# EAGLE design LGT-92 v1.5 (EAGLE 7.5.0)

## Sheet 1 of 3
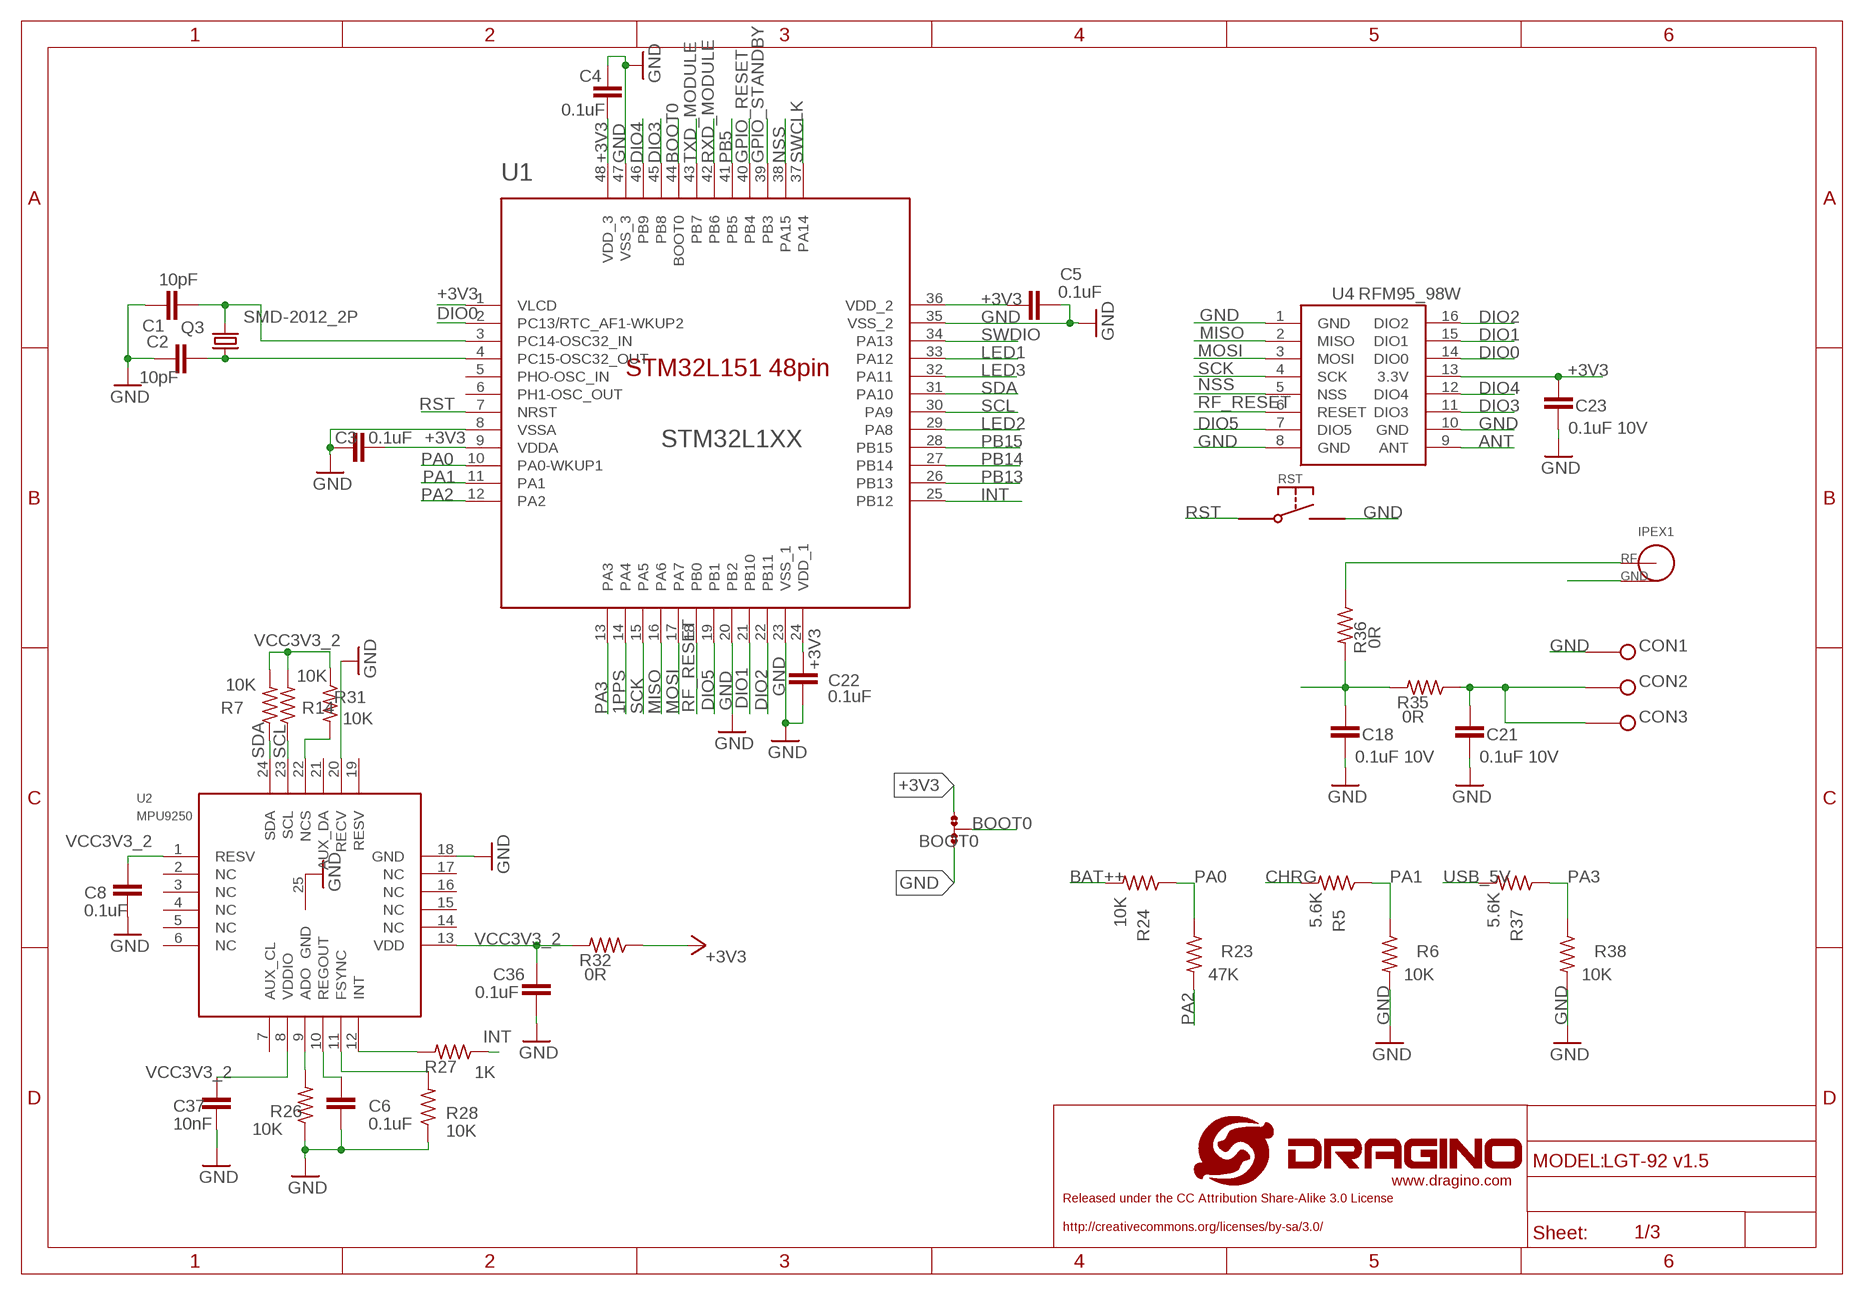
[diagram p0: schematic, sheet 1]

### Parts
BOOT0  0R-JUMPA0R-JMP-0402  [A0R-JMP-0402]
C1  10pF  C-EUC0402  [C0402]
C2  10pF  C-EUC0402  [C0402]
C3  0.1uF  C-EUC0402  [C0402]
C4  0.1uF  C-EUC0402  [C0402]
C5  0.1uF  C-EUC0402  [C0402]
C6  0.1uF  C-EUC0402  [C0402]
C8  0.1uF  C-EUC0402  [C0402]
C18  0.1uF 10V  C-EUC0402  [C0402]
C21  0.1uF 10V  C-EUC0402  [C0402]
C22  0.1uF  C-EUC0402  [C0402]
C23  0.1uF 10V  C-EUC0402  [C0402]
C36  0.1uF  C-EUC0402  [C0402]
C37  10nF  C-EUC0402  [C0402]
CON1  POGOPINSMT-2.0  [POGOPIN-SMT-2.0]
CON2  POGOPINSMT-2.0  [POGOPIN-SMT-2.0]
CON3  POGOPINSMT-2.0  [POGOPIN-SMT-2.0]
IPEX1  I-PEX  [I-PEX]
Q3  SMD-2012_2P  [32.768K]
R5  5.6K  R-US_R0402  [R0402]
R6  10K  R-US_R0402  [R0402]
R7  10K  R-US_R0402  [R0402]
R14  10K  R-US_R0402  [R0402]
R23  47K  R-US_R0402  [R0402]
R24  10K  R-US_R0402  [R0402]
R26  10K  R-US_R0402  [R0402]
R27  1K  R-US_R0402  [R0402]
R28  10K  R-US_R0402  [R0402]
R31  10K  R-US_R0402  [R0402]
R32  0R  R-US_R0402  [R0402]
R35  0R  R-US_R0402  [R0402]
R36  0R  R-US_R0402  [R0402]
R37  5.6K  R-US_R0402  [R0402]
R38  10K  R-US_R0402  [R0402]
RST  SWITCHTS-017  [TS-017]
U1  STM32L1XX  [STM32L1XX]
U2  MPU9250  [QFN-24]
U4  RFM95_98W  [RFM95_98W]

### Nets
1 [2layer_50ohm]: C21.2 CON2.1(TP) CON3.1(TP) R35.1
1PPS: U1.14(PA4) ; also sheet 3
+3V3: BOOT0.1 C3.1 C4.1 C5.2 C22.2 C23.2 R32.1 U1.1(VLCD) U1.9(VDDA) U1.24(VDD_1) U1.36(VDD_2) U1.48(VDD_3) U4.13(3.3V) ; also sheet 2,3
ANT [2layer_50ohm]: C18.2 R35.2 R36.2 U4.9(ANT)
BAT++: R24.2 ; also sheet 2,3
BOOT0: BOOT0.2 U1.44(BOOT0)
CHRG: R5.2 ; also sheet 2
DIO0: U1.2(PC13/RTC_AF1-WKUP2) U4.14(DIO0)
DIO1: U1.21(PB10) U4.15(DIO1)
DIO2: U1.22(PB11) U4.16(DIO2)
DIO3: U1.45(PB8) U4.11(DIO3)
DIO4: U1.46(PB9) U4.12(DIO4)
DIO5: U1.19(PB1) U4.7(DIO5)
GND [gnd]: BOOT0.3 C1.1 C2.1 C3.2 C4.2 C5.1 C6.1 C8.1 C18.1 C21.1 C22.1 C23.1 C36.1 C37.1 CON1.1(TP) IPEX1.GND IPEX1.GND1(GND) R6.2 R26.1 R28.1 R38.2 RST.P$2 U1.8(VSSA) U1.20(PB2) U1.23(VSS_1) U1.35(VSS_2) U1.47(VSS_3) U2.18(GND) U2.20(RECV) U2.25(GND) U4.1(GND) U4.8(GND) U4.10(GND) ; also sheet 2,3
GPIO_RESET: U1.40(PB4) ; also sheet 3
GPIO_STANDBY: U1.39(PB3) ; also sheet 3
INT: R27.1 U1.25(PB12)
LED1: U1.33(PA12) ; also sheet 3
LED2: U1.29(PA8) ; also sheet 3
LED3: U1.32(PA11) ; also sheet 3
MISO: U1.16(PA6) U4.2(MISO)
MOSI: U1.17(PA7) U4.3(MOSI)
N$9: C2.2 Q3.3 U1.4(PC15-OSC32_OUT)
N$12: C1.2 Q3.4 U1.3(PC14-OSC32_IN)
N$22: R31.2 U2.22(NCS)
N$23: IPEX1.SIG R36.1
N$44: R26.2 U2.9(ADO)
N$46: C6.2 U2.10(REGOUT)
N$48: R28.2 U2.11(FSYNC)
N$49: R27.2 U2.12(INT)
NSS: U1.38(PA15) U4.5(NSS)
PA0: R23.1 R24.1 U1.10(PA0-WKUP1)
PA1: R5.1 R6.1 U1.11(PA1)
PA2: R23.2 U1.12(PA2)
PA3: R37.1 R38.1 U1.13(PA3)
PB5: U1.41(PB5) ; also sheet 3
PB13: U1.26(PB13)
PB14: U1.27(PB14) ; also sheet 3
PB15: U1.28(PB15)
RF_RESET: U1.18(PB0) U4.6(RESET)
RST: RST.P$1 U1.7(NRST)
RXD_MODULE: U1.42(PB6) ; also sheet 3
SCK: U1.15(PA5) U4.4(SCK)
SCL: R14.1 U1.30(PA9) U2.23(SCL)
SDA: R7.1 U1.31(PA10) U2.24(SDA)
SWCLK: U1.37(PA14) ; also sheet 2
SWDIO: U1.34(PA13) ; also sheet 2
TXD_MODULE: U1.43(PB7) ; also sheet 3
USB_5V: R37.2 ; also sheet 2
VCC3V3_2: C8.2 C36.2 C37.2 R7.2 R14.2 R31.1 R32.2 U2.1(RESV) U2.8(VDDIO) U2.13(VDD)
Unconnected: U1.5(PHO-OSC_IN) U1.6(PH1-OSC_OUT) U2.2(NC) U2.3(NC) U2.4(NC) U2.5(NC) U2.6(NC) U2.7(AUX_CL) U2.14(NC) U2.15(NC) U2.16(NC) U2.17(NC) U2.19(RESV) U2.21(AUX_DA)

## Sheet 2 of 3
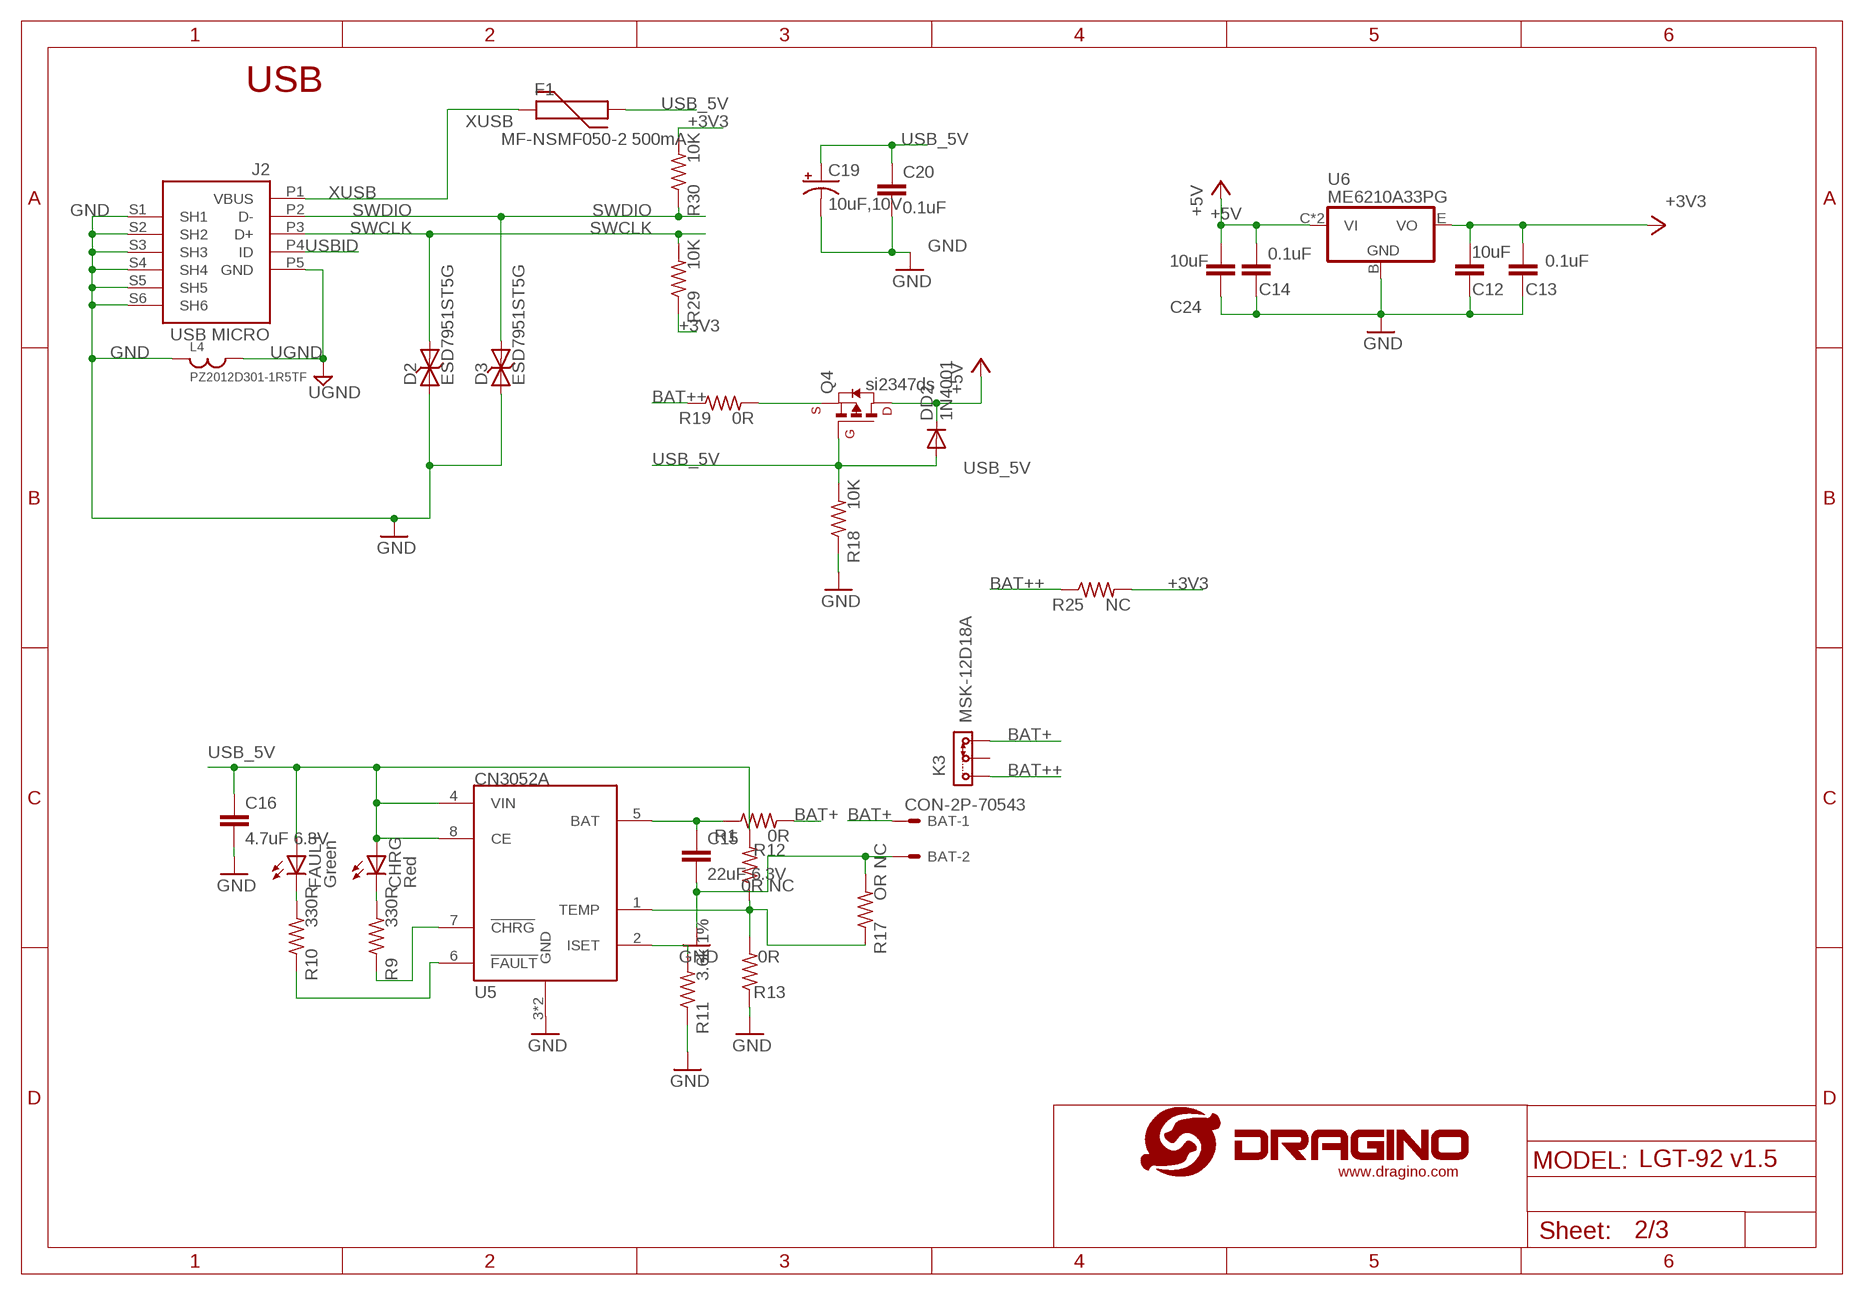
[diagram p1: schematic, sheet 2]

### Parts
BAT  CON-2P-70543  [70543-02]
C12  10uF  C-EUC0805  [C0805]
C13  0.1uF  C-EUC0402  [C0402]
C14  0.1uF  C-EUC0402  [C0402]
C15  22uF 6.3V  C-EUC0603  [C0603]
C16  4.7uF 6.3V  C-EUC0603  [C0603]
C19  10uF,10V  CPOL-USSMCA  [SMC_A]
C20  0.1uF  C-EUC0402  [C0402]
C24  10uF  C-EUC0805  [C0805]
CHRG  Red  DRAGINO_LEDCHIPLED_0603  [DRAGINO_CHIPLED_0603]
D2  ESD7951ST5G  TVSSOD?923  [SOD?923]
D3  ESD7951ST5G  TVSSOD?923  [SOD?923]
DD2  1N4001  DIODEDO214AC  [DIODE_DO214AC]
F1  MF-NSMF050-2 500mA  FUSE1206  [R1206$1]
FAULT  Green  DRAGINO_LEDCHIPLED_0603  [DRAGINO_CHIPLED_0603]
J2  USB MICRO  MYCON2_USB-MINI-B  [CON2_USB_MICRO_B_AT]
K3  MSK-12D18A  [MSK-12D18A]
L4  PZ2012D301-1R5TF  BEADS0805  [C0805]
Q4  si2347ds  P-MOSFET_HP  [SOT-23-HIGH-POWER]
R1  0R  R-US_R0805  [R0805]
R9  330R  R-US_R0402  [R0402]
R10  330R  R-US_R0402  [R0402]
R11  3.6k 1%  R-US_R0402  [R0402]
R12  0R NC  R-US_R0402  [R0402]
R13  0R  R-US_R0402  [R0402]
R17  OR NC  R-US_R0402  [R0402]
R18  10K  R-US_R0402  [R0402]
R19  0R  R-US_R0805  [R0805]
R25  NC  R-US_R0805  [R0805]
R29  10K  R-US_R0402  [R0402]
R30  10K  R-US_R0402  [R0402]
U5  CN3052A  [CN3052A]
U6  ME6210A33PG  [SOT-89]

### Nets
+3V3: C12.2 C13.2 R25.2 R29.1 R30.2 U6.E(VO) ; also sheet 1,3
+5V: C14.2 C24.2 DD2.C Q4.1(D) U6.C(VI) U6.C@1(VI)
BAT+: BAT.1 K3.3 R1.2
BAT++: K3.1 R19.1 R25.1 ; also sheet 1,3
CHRG: R9.1 U5.7(!CHRG) ; also sheet 1
GND [gnd]: BAT.2 C12.1 C13.1 C14.1 C15.2 C16.2 C19.- C20.2 C24.1 D2.P$1 D3.P$1 J2.S1(SH1) J2.S2(SH2) J2.S3(SH3) J2.S4(SH4) J2.S5(SH5) J2.S6(SH6) L4.1 R11.1 R13.1 R17.2 R18.1 U5.3(GND) U5.P$1(GND) U6.B(GND) ; also sheet 1,3
N$1: C15.1 R1.1 U5.5(BAT)
N$4: CHRG.C R9.2
N$7: FAULT.C R10.2
N$8: Q4.2(S) R19.2
N$11: R10.1 U5.6(!FAULT)
N$15: R12.1 R13.2 R17.1 U5.1(TEMP)
N$16: R11.2 U5.2(ISET)
SWCLK: D2.P$2 J2.P3(D+) R29.2 ; also sheet 1
SWDIO: D3.P$2 J2.P2(D-) R30.1 ; also sheet 1
UGND [gnd]: J2.P5(GND) L4.2
USB_5V: C16.1 C19.+ C20.1 CHRG.A DD2.A F1.1 FAULT.A Q4.3(G) R12.2 R18.2 U5.4(VIN) U5.8(CE) ; also sheet 1
USBID: J2.P4(ID)
XUSB [usbvcc]: F1.2 J2.P1(VBUS)
Unconnected: K3.2

### Notes on the sheet
- USB

## Sheet 3 of 3
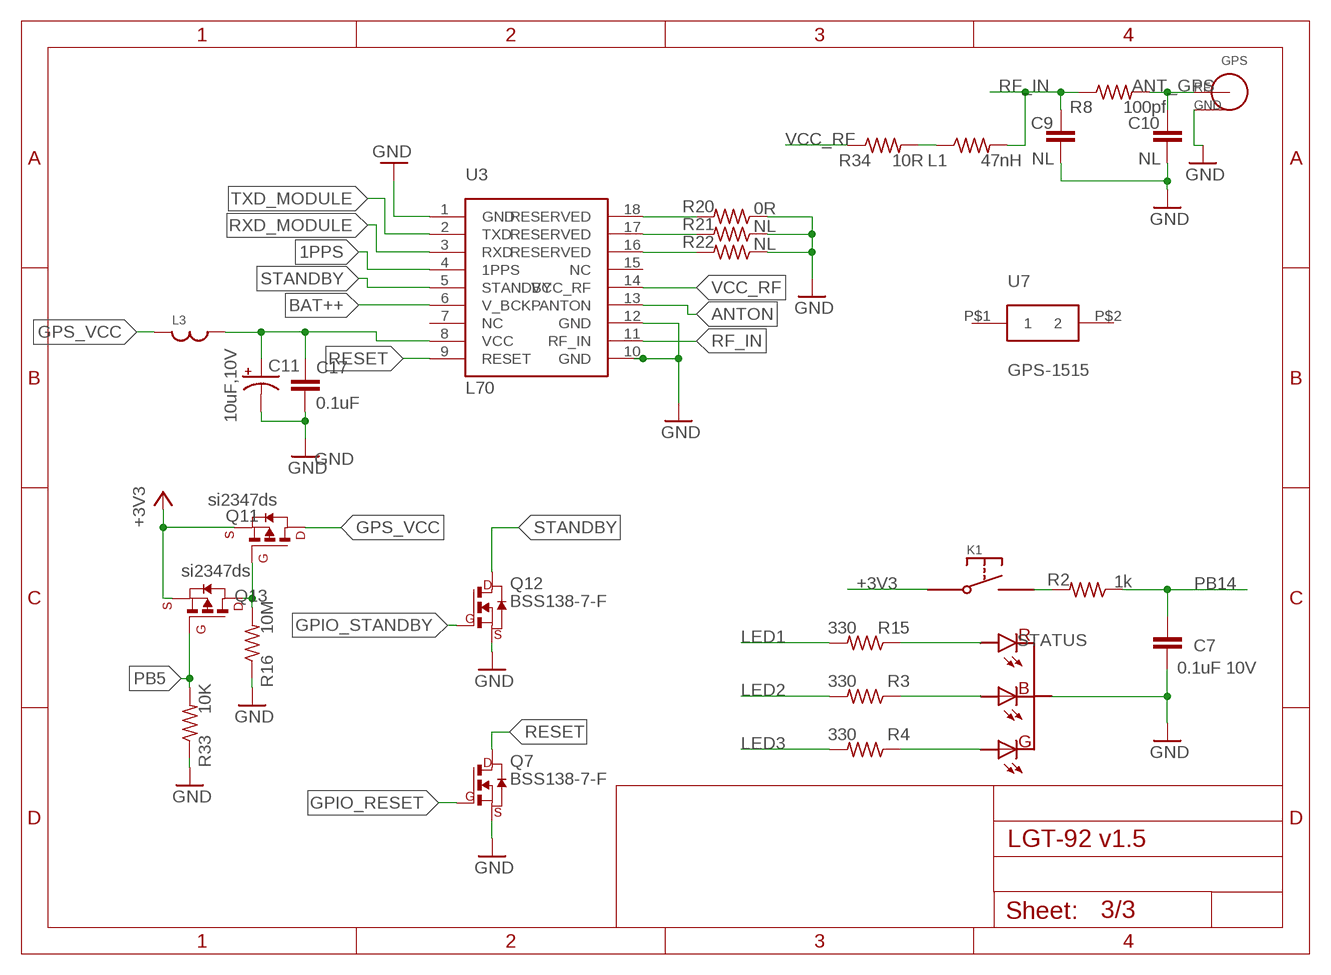
[diagram p2: schematic, sheet 3]

### Parts
C7  0.1uF 10V  C-EUC0402  [C0402]
C9  NL  C-EUC0402  [C0402]
C10  NL  C-EUC0402  [C0402]
C11  10uF,10V  CPOL-USSMCA  [SMC_A]
C17  0.1uF  C-EUC0402  [C0402]
GPS  I-PEX,NL  I-PEX  [I-PEX]
K1  S-LAY  [KEY]
L1  47nH  R-US_R0402  [R0402]
L3  JLC-PZ2012D800-3R0TF  BEADS0805  [C0805]
Q7  BSS138-7-F  NMOSFET  [SOT-23]
Q11  si2347ds  P-MOSFET_HP  [SOT-23-HIGH-POWER]
Q12  BSS138-7-F  NMOSFET  [SOT-23]
Q13  si2347ds  P-MOSFET_HP  [SOT-23-HIGH-POWER]
R2  1k  R-US_R0402  [R0402]
R3  330  R-US_R0402  [R0402]
R4  330  R-US_R0402  [R0402]
R8  100pf  R-US_R0402  [R0402]
R15  330  R-US_R0402  [R0402]
R16  10M  R-US_R0402  [R0402]
R20  0R  R-US_R0402  [R0402]
R21  NL  R-US_R0402  [R0402]
R22  NL  R-US_R0402  [R0402]
R33  10K  R-US_R0402  [R0402]
R34  10R  R-US_R0402  [R0402]
STATUS  LED-RGB-THR-5MM-GNDSMD-3528  [LED-3528]
U3  L70  [L70]
U7  GPS-1515  [GPS-YY]

### Nets
1PPS: U3.4(1PPS) ; also sheet 1
+3V3: K1.1 K1.2 K1.5 Q11.2(S) Q13.2(S) ; also sheet 1,2
ANT_GPS [2layer_50ohm]: C10.1 GPS.SIG R8.2
ANTON: U3.13(ANTON)
BAT++: U3.6(V_BCKP) ; also sheet 1,2
GND [gnd]: C7.1 C9.2 C10.2 C11.- C17.2 GPS.GND GPS.GND1(GND) Q7.2(S) Q12.2(S) R16.1 R20.1 R21.1 R22.1 R33.1 STATUS.+(C) U3.1(GND) U3.10(GND) U3.12(GND) ; also sheet 1,2
GPIO_RESET: Q7.3(G) ; also sheet 1
GPIO_STANDBY: Q12.3(G) ; also sheet 1
GPS_VCC: L3.1 Q11.1(D)
GPS_VCC1: C11.+ C17.1 L3.2 U3.8(VCC)
LED1: R15.2 ; also sheet 1
LED2: R3.2 ; also sheet 1
LED3: R4.2 ; also sheet 1
N$2: L1.1 R34.2
N$6: R15.1 STATUS.R-
N$14: Q11.3(G) Q13.1(D) R16.2
N$17: K1.3 K1.4 K1.6 R2.2
N$18: R3.1 STATUS.B-
N$19: R4.1 STATUS.G-
N$37: R20.2 U3.18(RESERVED)
N$38: R21.2 U3.17(RESERVED)
N$39: R22.2 U3.16(RESERVED)
PB5: Q13.3(G) R33.2 ; also sheet 1
PB14: C7.2 R2.1 ; also sheet 1
RESET: Q7.1(D) U3.9(RESET)
RF_IN [2layer_50ohm]: C9.1 L1.2 R8.1 U3.11(RF_IN)
RXD_MODULE: U3.3(RXD) ; also sheet 1
STANDBY: Q12.1(D) U3.5(STANDBY)
TXD_MODULE: U3.2(TXD) ; also sheet 1
VCC_RF: R34.1 U3.14(VCC_RF)
Unconnected: U3.7(NC) U3.15(NC) U7.P$1 U7.P$2

## Library data of the parts
BAT = dragino-passive:CON-2P: CONNECTOR wire to board 2.54 mm (0.100") pitch header; OC_FARNELL: unknown; OC_NEWARK: unknown
BOOT0 = dragino:0R-JUMP: SMD 0R 0805 Jumper
C1-C5 C7 C9 C10 C17 C18 C20-C23 = dragino-passive:C-EU: CAPACITOR, European symbol
C6 C8 C12-C16 C24 C36 C37 = dragino:C-EU: CAPACITOR, European symbol
C11 C19 = rcl:CPOL-US: POLARIZED CAPACITOR, American symbol
CHRG FAULT = Lora Shield v1.1.1:DRAGINO_LED: LED OSRAM: - CHIPLED LG R971, LG N971, LY N971, LG Q971, LY Q971, LO R971, LY R971 LH N974, LH R974 LS Q976, LO Q976, LY Q976 LO Q996 - Hyper CHIPLED LW Q18S LB Q993, LB Q99A, LB R99A - SideLED LS A670, LO A670, LY A670, LG A670, LP A670 LB A673, LV A673, LT A673, LW A673 LH A674 LY A675 LS A676, LA A676, LO A676, LY A676, LW A676 LS A679, LY A679, LG A679 - Hyper Micro SIDELED? LS Y876, LA Y876, LO Y876, LY Y876 LT Y87S - SmartLED LW L88C, LW L88S LB L89C, LB L89S, LG L890 LS L89K, LO L89K, LY L89K LS L896, LA L896, LO L896, LY L896 - TOPLED LS T670, LO T670, LY T670, LG T670, LP T670 LSG T670, LSP T670, LSY T670, LOP T670, LYG T670 LG T671, LOG T671, LSG T671 LB T673, LV T673, LT T673, LW T673 LH T674 LS T676, LA T676, LO T676, LY T676, LB T676, LH T676, LSB T676, LW T676 LB T67C, LV T67C, LT T67C, LS T67K, LO T67K, LY T67K, LW E67C LS E67B, LA E67B, LO E67B, LY E67B, LB E67C, LV E67C, LT E67C LW T67C LS T679, LY T679, LG T679 LS T770, LO T770, LY T770, LG T770, LP T770 LB T773, LV T773, LT T773, LW T773 LH T774 LS E675, LA E675, LY E675, LS T675 LS T776, LA T776, LO T776, LY T776, LB T776 LHGB T686 LT T68C, LB T68C - Hyper Mini TOPLED? LB M676 - Mini TOPLED Santana? LG M470 LS M47K, LO M47K, LY M47K Source: http://www.osram.convergy.de LUXEON: - LUMILED? LXK2-PW12-R00, LXK2-PW12-S00, LXK2-PW14-U00, LXK2-PW14-V00 LXK2-PM12-R00, LXK2-PM12-S00, LXK2-PM14-U00 LXK2-PE12-Q00, LXK2-PE12-R00, LXK2-PE12-S00, LXK2-PE14-T00, LXK2-PE14-U00 LXK2-PB12-K00, LXK2-PB12-L00, LXK2-PB12-M00, LXK2-PB14-N00, LXK2-PB14-P00, LXK2-PB14-Q00 LXK2-PR12-L00, LXK2-PR12-M00, LXK2-PR14-Q00, LXK2-PR14-R00 LXK2-PD12-Q00, LXK2-PD12-R00, LXK2-PD12-S00 LXK2-PH12-R00, LXK2-PH12-S00 LXK2-PL12-P00, LXK2-PL12-Q00, LXK2-PL12-R00 Source: www.luxeon.com KINGBRIGHT: KA-3528ASYC Source: www.kingbright.com
CON1-CON3 = dragino-passive:POGOPIN
D2 D3 = dragino:TVS: DIODE
DD2 = dragino:DIODE: DIODE
F1 = dragino:FUSE: FUSE 5 x 20 mm
GPS IPEX1 = dragino-passive:I-PEX: I-PEX, U.F.L connector
J2 = SmartPrj:MYCON2_USB-MINI-B
K1 = dragino:S-LAY
K3 = dragino1:MSK-12D18A
L1 R1-R38 = dragino:R-US_: RESISTOR, American symbol
L3 L4 = dragino:BEADS
Q3 = crystal:SMD-2012_2P: kHz RANGE CRYSTAL UNIT SMD Source: MC-306_405_406_E07X.PDF Homepage <http://www.epsontoyocom.co.jp>
Q4 Q11 Q13 = dragino:P-MOSFET
Q7 Q12 = dragino:NMOSFET: MOS FET; OC_FARNELL: unknown; OC_NEWARK: unknown
RST = dragino:SWITCH
STATUS = dragino:LED-RGB-THR-5MM-GND: DUO LED 2 colors (red/green), 5 mm, round, common Anode www.ligitek.com or other producers.
U1 = dragino:STM32L1XX
U2 = dragino:MPU9250
U3 = dragino:L70
U4 = dragino:RFM95_98W
U5 = 328PAU:CN3052A
U6 = dragino:ME6210A33PG
U7 = dragino:GPS-15*15

## Net classes
0 default: width 0.203 mm, clearance 0.152 mm
1 2layer_50ohm: width 1.001 mm, clearance 0.2 mm
2 gnd: width 0.305 mm, drill 0.254 mm, clearance 0.203 mm
3 usbvcc: width 0.203 mm, drill 0.33 mm, clearance 0.254 mm

## Board
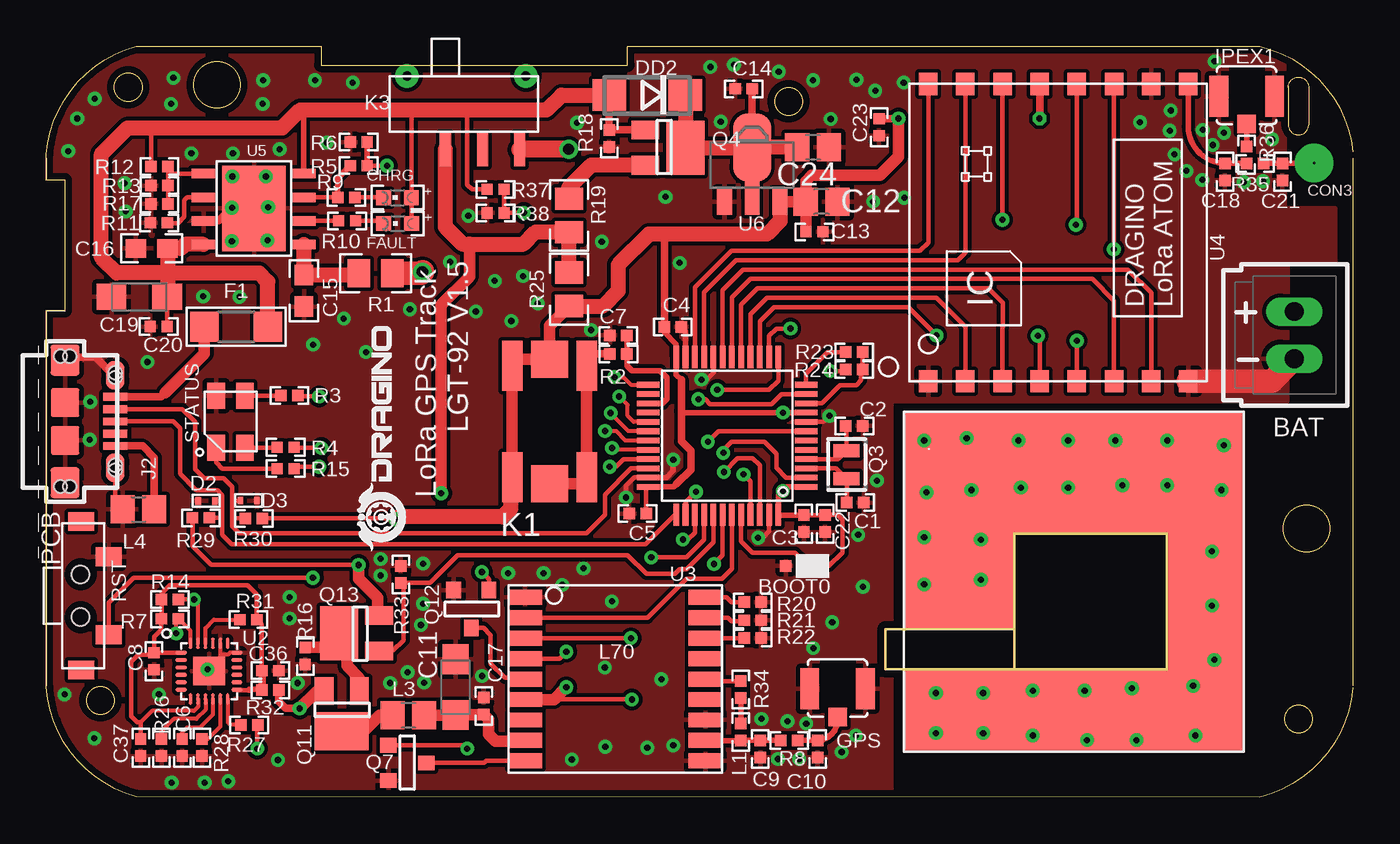
[diagram p3: board, top side]
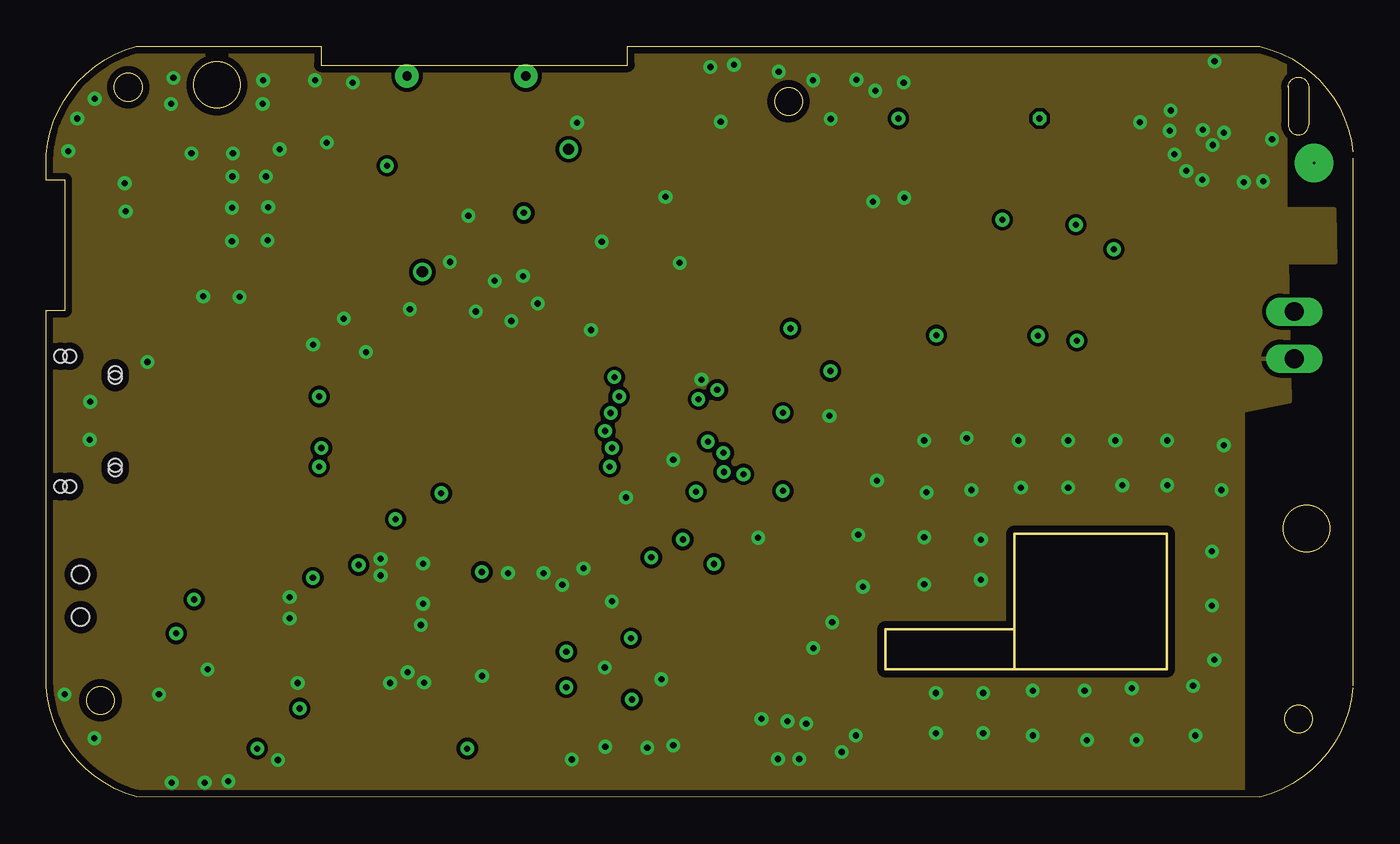
[diagram p4: board, inner layer Route2]
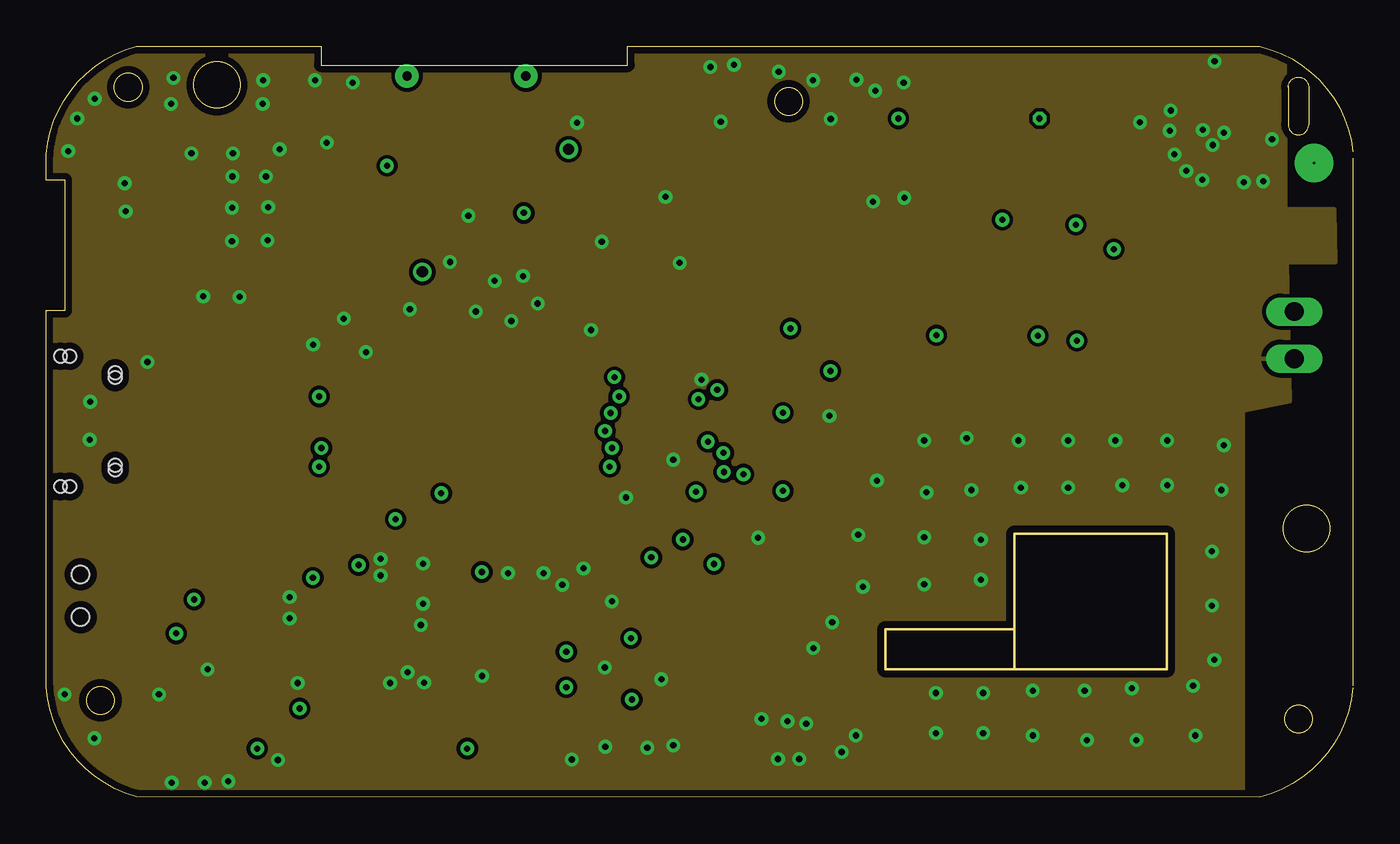
[diagram p5: board, inner layer Route15]
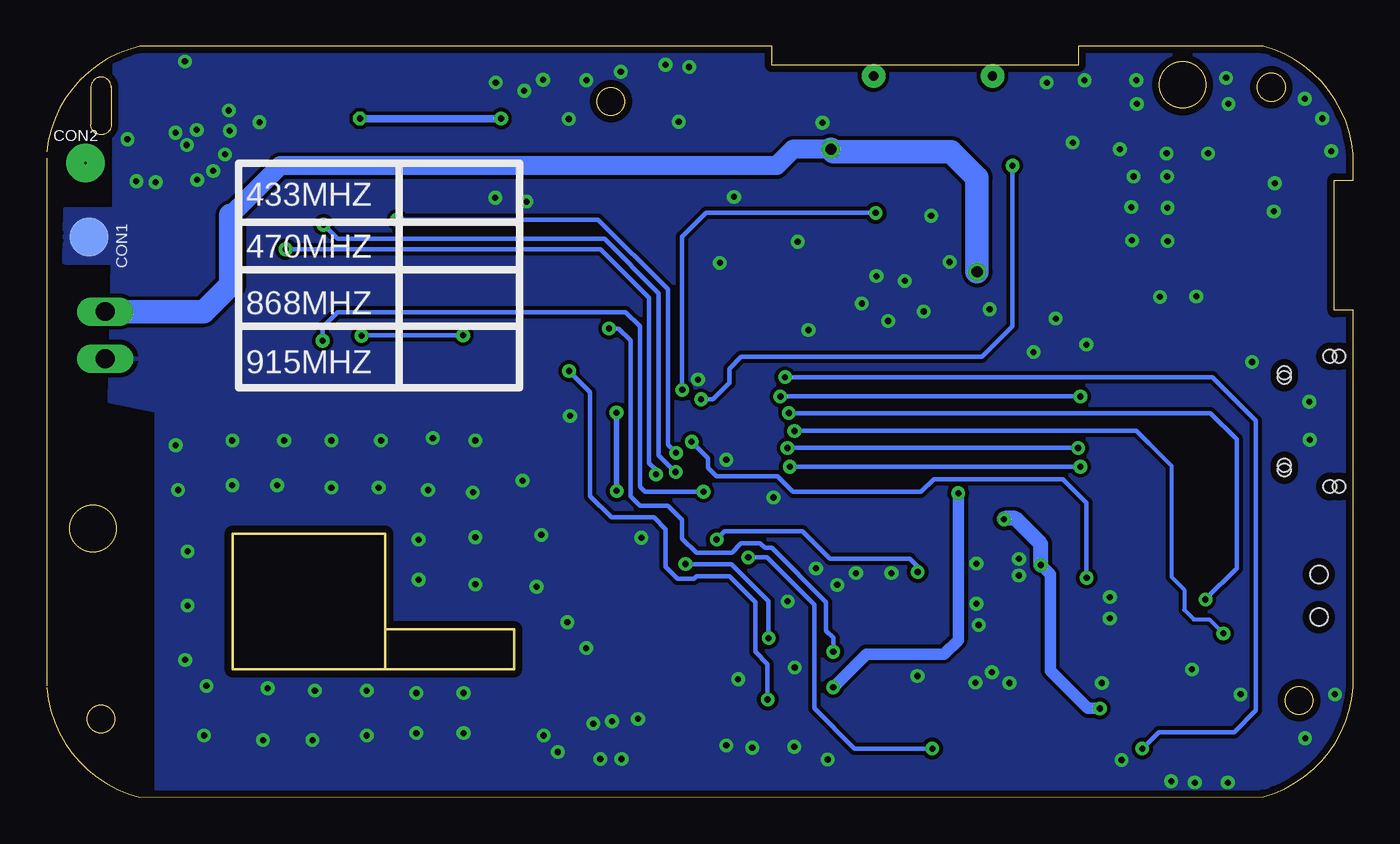
[diagram p6: board, bottom side, seen from below]

Size 70.33 x 40.4 mm. Coordinates in mm from the lower left corner, seen from the top.
Outline: 70.33,34.39 70.33,5.99
Outline: 66.86,38.25 66.86,36.19 arc180 67.96,36.19 67.96,38.24
Outline: 70.33,34.74 arc71 65.33,40.4 31.29,40.4 31.29,39.4 14.78,39.4 14.78,40.4 4.85,40.4 arc71 0,34.59 0,33.2 1,33.2 1,26.2 0,26.2 0,5.91 arc71 4.85,0.03 65.33,0 arc71 70.33,5.89
Outline: 66.86,38.21 arc-180 67.96,38.2
Outline: circle at 4.4,38.2 radius 0.75
Outline: circle at 2.91,5.2 radius 0.75
Outline: circle at 67.41,4.2 radius 0.75
Outline: circle at 39.96,37.44 radius 0.75
Outline: circle at 67.85,14.46 radius 1.25
Outline: circle at 9.17,38.33 radius 1.25
Copper layers (1*2+15*16): Top 0.035mm / dielectric 1.5mm / Route2 0.035mm / dielectric 0.15mm / Route15 0.035mm / dielectric 0.2mm / Bottom 0.035mm
Design rules "default *": minimum track width 6mil, minimum drill 10mil, track to track 6mil, track to pad 6mil, pad to pad 6mil, via to via 6mil, smd to smd 6mil, copper to edge 15mil, drill to drill 8mil, minimum pad ring 10mil, minimum via ring 8mil, stop-mask expansion 4mil, vias tented up to drill 30mil, thermal gap 10mil

### Footprints (pad centres in the part's own frame; a part is rotated, then mirrored left to right if it is on the bottom)
70543-02 = drill 1.016 long: 1 -1.27,0; 2 1.27,0
A0R-JMP-0402 = smd 0.61 x 0.61: 1 0,0.914; 2 0,0; 3 0,-0.914
C0402 = smd 0.61 x 0.61: 1 -0.457,0; 2 0.457,0
SMC_A = smd 1.6 x 1.4: + -1.5,0; - 1.5,0
C0805 = smd 1.3 x 1.5: 1 -0.85,0; 2 0.85,0
C0603 = smd 1.1 x 1: 1 -0.85,0; 2 0.85,0
DRAGINO_CHIPLED_0603 = smd 0.8 x 0.8: A 0,-0.75; C 0,0.75
POGOPIN-SMT-2.0 = smd 2.1 x 2.1: 1 0,0
SOD?923 = smd 0.3 x 0.4: P$1 -0.45,0; P$2 0.45,0
DIODE_DO214AC = smd 1.8 x 1.7: A 2.05,0; C -2.05,0
R1206$1 = smd 1.52 x 1.6: 1 -1.71,0; 2 1.71,0
I-PEX = smd 1 x 2.2: GND -1.65,-0.27; GND1 1.35,-0.27 | smd 1 x 1: SIG -0.15,-1.77
CON2_USB_MICRO_B_AT = smd 0.406 x 1.346: P1 -1.321,2.692; P2 -0.66,2.692; P3 0,2.692; P4 0.66,2.692; P5 1.321,2.692 | smd 1.651 x 1.549: S1 -3.302,0; S2 3.302,0 | smd 1.524 x 1.016: S3 -2.489,2.692; S4 2.489,2.692 | smd 1.524 x 1.524: S5 -1.016,0; S6 1.016,0 | hole 0.7: -3.505,0.254; -3.505,-0.254; 3.505,0.254; 3.505,-0.254; -2.616,2.692; -2.362,2.692; 2.362,2.692; 2.616,2.692
KEY = smd 2.7 x 1.1: 1 -3,2; 2 3,2; 3 3,-2; 4 -3,-2 | smd 2 x 2: 5 3.35,0; 6 -3.35,0
MSK-12D18A = smd 0.6 x 1.8: 1 -2,-0.152; 2 0,-0.152; 3 2,-0.152 | drill 0.5 pad 1.27: P$1 -4.06,3.81; P$2 2.34,3.81
R0402 = smd 0.61 x 0.61: 1 -0.457,0; 2 0.457,0
32.768K = smd 0.7 x 1.4: 3 0.78,0.03; 4 -0.72,0.03
SOT-23-HIGH-POWER = smd 2.9 x 2.05: 1 0,-1.143 | smd 1 x 1.5: 2 -0.95,1.016; 3 0.95,1.016
SOT-23 = smd 0.787 x 0.889: 1 0,-1.016; 2 -0.95,1.016; 3 0.95,1.016
R0805 = smd 1.2 x 1.5: 1 -0.9,0; 2 0.9,0
TS-017 = smd 1 x 1.4: P$1 -2.1,-1.5; P$2 2.1,-1.5; P$3 -3.994,-0.034; P$4 3.994,-0.034 | hole 0.95: -1.15,0; 1.15,0
LED-3528 = smd 1.4 x 0.95: + -1.4,-0.775; B- -1.4,0.775; G- 1.4,0.775; R- 1.4,-0.775
STM32L1XX = smd 1.2 x 0.3: 1 -4.25,2.75; 2 -4.25,2.25; 3 -4.25,1.75; 4 -4.25,1.25; 5 -4.25,0.75; 6 -4.25,0.25; 7 -4.25,-0.25; 8 -4.25,-0.75; 9 -4.25,-1.25; 10 -4.25,-1.75; 11 -4.25,-2.25; 12 -4.25,-2.75; 25 4.25,-2.75; 26 4.25,-2.25; 27 4.25,-1.75; 28 4.25,-1.25; 29 4.25,-0.75; 30 4.25,-0.25; 31 4.25,0.25; 32 4.25,0.75; 33 4.25,1.25; 34 4.25,1.75; 35 4.25,2.25; 36 4.25,2.75 | smd 0.3 x 1.2: 13 -2.75,-4.25; 14 -2.25,-4.25; 15 -1.75,-4.25; 16 -1.25,-4.25; 17 -0.75,-4.25; 18 -0.25,-4.25; 19 0.25,-4.25; 20 0.75,-4.25; 21 1.25,-4.25; 22 1.75,-4.25; 23 2.25,-4.25; 24 2.75,-4.25; 37 2.75,4.25; 38 2.25,4.25; 39 1.75,4.25; 40 1.25,4.25; 41 0.75,4.25; 42 0.25,4.25; 43 -0.25,4.25; 44 -0.75,4.25; 45 -1.25,4.25; 46 -1.75,4.25; 47 -2.25,4.25; 48 -2.75,4.25
QFN-24 = smd 0.6 x 0.2: 1 -1.5,1; 2 -1.5,0.6; 3 -1.5,0.2; 4 -1.5,-0.2; 5 -1.5,-0.6; 6 -1.5,-1; 13 1.5,-1; 14 1.5,-0.6; 15 1.5,-0.2; 16 1.5,0.2; 17 1.5,0.6; 18 1.5,1 | smd 0.2 x 0.6: 7 -1,-1.5; 8 -0.6,-1.5; 9 -0.2,-1.5; 10 0.2,-1.5; 11 0.6,-1.5; 12 1,-1.5; 19 1,1.5; 20 0.6,1.5; 21 0.2,1.5; 22 -0.2,1.5; 23 -0.6,1.5; 24 -1,1.5 | smd 1.7 x 1.54: 25 0,0
L70 = smd 1.8 x 0.8: 1 4.85,-4.4; 2 4.85,-3.3; 3 4.85,-2.2; 4 4.85,-1.1; 5 4.85,0; 6 4.85,1.1; 7 4.85,2.2; 8 4.85,3.3; 9 4.85,4.4; 10 -4.85,4.4; 11 -4.85,3.3; 12 -4.85,2.2; 13 -4.85,1.1; 14 -4.85,0; 15 -4.85,-1.1; 16 -4.85,-2.2; 17 -4.85,-3.3; 18 -4.85,-4.4
RFM95_98W = smd 1.2 x 1: 1 -8,5.73; 2 -8,3.73; 3 -8,1.73; 4 -8,-0.27; 5 -8,-2.27; 6 -8,-4.27; 7 -8,-6.27; 8 -8,-8.27; 9 8,-8.27; 10 8,-6.27; 11 8,-4.27; 12 8,-2.27; 13 8,-0.27; 14 8,1.73; 15 8,3.73; 16 8,5.73
CN3052A = smd 1.27 x 0.51: 1 -2.71,1.87; 2 -2.71,0.6; 3 -2.71,-0.67; 4 -2.71,-1.94; 5 2.69,-1.94; 6 2.69,-0.67; 7 2.69,0.6; 8 2.69,1.87 | smd 3.4 x 4.6: P$1 0,0
SOT-89 = smd 0.8 x 1.4: B -1.499,-1.981; E 1.499,-1.981 | smd 0.8 x 1.9: C 0,-1.727 | smd 2.032 x 3.65: C@1 0,0.94
GPS-YY = smd 5.95 x 11.7: P$1 -6.172,3.302 | smd 8.2 x 6.55: P$2 0.889,5.878 | smd 4.15 x 18.3: P$3 7.061,0 | smd 14.15 x 4.45: P$4 -2.108,-6.934

### Placement (x,y rotation side)
BAT  67.18,24.86 270 top
BOOT0  40.72,12.44 270 top
C1  43.54,15.85 180 top
C2  43.5,19.98 180 top
C3  40.78,14.72 270 top
C4  33.72,25.31 0 top
C5  31.83,15.26 0 top
C6  7.31,2.66 90 top
C7  30.79,24.85 0 top
C8  5.79,7.31 90 top
C9  38.43,2.59 270 top
C10  41.52,2.59 270 top
C11  22.02,5.91 90 top
C12  41.73,32.05 180 top
C13  41.35,30.43 180 top
C14  37.54,38.12 0 top
C15  13.86,27.25 270 top
C16  5.67,29.53 180 top
C17  23.54,4.9 90 top
C18  63.45,33.65 90 top
C19  5,26.92 180 top
C20  6.04,25.33 180 top
C21  66.55,33.65 90 top
C22  41.92,14.72 90 top
C23  44.83,36.05 90 top
C24  41.27,34.97 180 top
C36  12.06,6.8 180 top
C37  5.08,2.66 90 top
CHRG  18.9,32.27 90 top
CON1  68.05,30.16 0 bottom
CON2  68.25,34.13 0 bottom
CON3  68.25,34.13 0 top
D2  8.62,15.95 0 top
D3  10.88,15.96 180 top
DD2  32.35,37.79 180 top
F1  10.21,25.32 180 top
FAULT  18.91,30.87 90 top
GPS  42.75,6.09 0 top
IPEX1  64.77,38 0 top
J2  1.01,20.22 270 top
K1  27.08,20.22 90 top
K3  23.47,34.99 0 top
L1  37.39,3.5 270 top
L3  19.48,4.42 0 top
L4  4.95,15.49 0 top
Q3  43.09,17.85 90 top
Q4  33.26,34.96 90 top
Q7  19.43,1.84 90 top
Q11  15.9,4.69 0 top
Q12  22.87,10.12 0 top
Q13  16.9,8.82 270 top
R1  17.73,28.19 0 top
R2  30.79,23.86 180 top
R3  13.08,21.61 0 top
R4  12.88,18.83 0 top
R5  16.81,33.98 180 top
R6  16.81,35.25 180 top
R7  6.65,9.6 180 top
R8  39.99,3.05 0 top
R9  16.14,32.28 0 top
R10  16.19,31.02 0 top
R11  6.06,30.91 0 top
R12  6.09,33.93 180 top
R13  6.09,32.92 0 top
R14  6.65,10.64 180 top
R15  12.88,17.68 0 top
R16  13.93,7.6 90 top
R17  6.09,31.92 180 top
R18  30.3,35.45 90 top
R19  28.13,31.31 90 top
R20  38.02,10.5 180 top
R21  38.02,9.52 180 top
R22  38.02,8.56 180 top
R23  43.48,23.95 180 top
R24  43.48,23.01 180 top
R25  28.14,27.33 270 top
R26  6.19,2.66 90 top
R27  10.92,3.88 180 top
R28  8.38,2.66 90 top
R29  8.32,15.03 0 top
R30  11.17,15 0 top
R31  10.87,9.55 180 top
R32  12.06,5.76 180 top
R33  19.07,11.99 270 top
R34  37.39,5.79 270 top
R35  65.07,34.11 180 top
R36  64.61,34.57 270 top
R37  24.18,32.71 180 top
R38  24.18,31.44 180 top
RST  1.84,10.84 90 top
STATUS  9.91,20.2 270 top
U1  36.65,19.44 180 top
U2  8.76,6.78 0 top
U3  30.62,6.35 180 top
U4  53.2,30.38 90 top
U5  11.17,31.68 0 top
U6  38,34.03 0 top
U7  55.32,11.58 0 top
U$1  [LOGO-DRAGINO-2018]  19.35,13.23 90 top

### Tracks (layer width: path | path; a pad name or v marks a point on that pad's centre or on a via)
1  (1 unrouted)
  Top 0.293: R35.1 C21.2 68.22,34.11 arc90 CON3.1
1PPS  (via drill 0.33)
  Top 0.254: v27.99,7.82 27.62,7.45 U3.4 | U1.14 38.9,24.83 39.29,25.22 v40.05,25.22
  Bottom 0.254: v27.99,7.82 27.99,8.58 28.37,8.96 28.37,10.49 31.29,13.41 31.67,13.41 31.93,13.66 32.94,13.66 33.45,13.15 35.35,13.15 36.12,13.92 36.12,14.93 36.88,15.69 38.4,15.69 38.91,16.2 38.91,24.58 39.55,25.22 v40.05,25.22
+3V3  (via drill 0.33)
  Top 0.254: C3.1 C22.2 41.94,15.19 42.59,15.19 42.85,14.93 42.85,13.15 42.14,12.44 BOOT0.1 | 26.7,23.22 arc90 26.69,23.22 | R29.1 7.87,13.49 8.86,12.49 v16.81,12.49 | C5.2 32.29,16.57 U1.36 | R30.2 18.75,15 v18.79,14.96
  Top 0.305: C3.1 39.42,15.17 U1.48 39.4,16.24 v39.65,16.48 39.86,16.69 U1.1 | U1.36 33.76,16.69 33.93,16.86 | C4.1 33.26,25.02 33.9,24.38 U1.24 33.9,22.73 34.19,22.45 | U1.9 v39.66,20.69 34.27,20.69 34.19,20.77
  Top 0.406: U4.13 v53.47,36.53 v53.46,36.52 | v45.87,36.52 44.84,36.52 C23.2 46.03,36.51 | K1.5 26.7,23.57 26.7,23.22 | 33.93,16.86 34.69,17.62 34.69,18.64 34.19,19.15 34.19,20.77 34.19,22.45 | C4.1 33.27,30.25 33.32,30.3 | R32.1 12.49,5.74 12.49,5.15 12.88,4.77 v13.64,4.77
  Top 0.61: 25,17.14 K1.1 K1.2 25.43,23.57 K1.5 27.07,25.36 R25.2 | v16.81,12.49 16.81,11.76 17.83,10.74 17.83,9.85 Q13.2 | Q11.2 14.57,5.71 v13.64,4.77 | C12.2 40.88,30.44 C13.2 | U6.E C12.2 | C12.2 | C12.2 40.88,33.16 41.2,33.47 44.88,33.47 45.87,34.46 v45.87,36.52
  Top 0.813: 25,17.14 25,15.52 24.56,15.08 18.92,15.08 v18.79,14.96 | U6.E 39.5,31.01 38.78,30.3 33.32,30.3 32.43,30.3 30.78,28.65 30.78,27.25 29.96,26.43 R25.2
  Bottom 0.305: v39.66,20.69 39.66,16.49 v39.65,16.48
  Bottom 0.406: v53.46,36.52 v45.87,36.52
  Bottom 0.61: v16.81,12.49 16.3,11.99 16.3,6.8 14.27,4.77 v13.64,4.77
  Bottom 0.813: v16.81,12.49 16.81,13.63 18.18,15 18.75,15 v18.79,14.96
+5V
  Top 0.406: C14.2 U6.C@1
  Top 0.813: DD2.C 34.4,34.97 Q4.1 37.98,34.96 U6.C@1 | C24.2 U6.C@1 | U6.C@1 | U6.C@1 U6.C
ANT
  Top 0.293: U4.9 61.47,36.08 arc90 C18.2 R35.2
ANT_GPS
  Top 0.293: R8.2 C10.1 | 41.58,3.05 arc90 GPS.SIG
  Top 0.61: R8.2 | C10.1 41.58,3.05
BAT+  (via drill 0.6)
  Top 0.914: v28.12,34.87 25.5,34.87 K3.3
  Top 1.27: R1.2 20.17,28.19 v20.24,28.27
  Bottom 1.016: v28.12,34.87 30.15,34.87 31.04,33.98 57.76,33.98 60.42,31.31
  Bottom 1.27: 60.42,31.31 60.42,27.58 61.87,26.13 BAT.1 | v20.24,28.27 20.24,33.35 21.64,34.74 27.99,34.74 v28.12,34.87
BAT++  (via drill 0.33)
  Top 0.254: v31.52,5.25 U3.6 | v42.21,22.93 42.95,22.93 R24.2
  Top 0.61: v27.99,5.91 27.33,5.25 U3.6 | v21.26,16.35 21.26,26.49 22.78,28.01 22.78,29.76
  Top 0.813: K3.1 21.47,30.69 22.4,29.76 22.78,29.76 25.68,29.76 26.34,30.43 28.11,30.43 R19.1 R25.1
  Bottom 0.254: v31.52,5.25 31.52,7.16 32.18,7.82 32.18,10.49 33.58,11.88 35.35,11.88 35.48,11.76 36.37,11.76 37.01,12.39 37.01,14.42 37.64,15.06 39.93,15.06 41.07,16.2 41.07,21.79 v42.21,22.93
  Bottom 0.61: v21.26,16.35 21.26,8.45 22.02,7.69 26.21,7.69 v27.99,5.91
BOOT0
  Top 0.254: U1.44 37.4,13.77 38.02,13.15 40.31,13.15 40.72,12.74 BOOT0.2
CHRG
  Top 0.254: U5.7 R9.1
  Top 0.305: R9.1 15.68,33.31 R5.2
DIO0  (via drill 0.33)
  Top 0.254: U4.14 v51.47,31.08 | U1.2 39.83,17.19 39.29,17.73 39.29,18.49 38.66,19.12 36.88,19.12 36.44,18.69 v36.44,18.52
  Bottom 0.254: v51.47,31.08 51.46,31.09 40.64,31.09 36.88,27.33 36.88,18.96 v36.44,18.52
DIO1
  Top 0.254: U4.15 49.47,29.3 49.07,28.9 37.13,28.9 35.4,27.17 U1.21
DIO2
  Top 0.254: U4.16 47.47,29.84 47.04,29.41 36.88,29.41 34.9,27.44 U1.22
DIO3  (via drill 0.33)
  Top 0.254: U4.11 v57.47,29.49 | U1.45 37.9,16.99 v37.52,17.37
  Bottom 0.254: v57.47,29.49 40.51,29.49 37.89,26.87 37.89,17.98 37.52,17.61 v37.52,17.37
DIO4  (via drill 0.33)
  Top 0.254: U4.12 55.47,30.86 v55.42,30.81 | U1.46 38.4,17.85 38.02,18.23 37.21,18.23 v36.47,17.5
  Bottom 0.254: v55.42,30.81 54.66,30.04 40.31,30.04 37.39,27.12 37.39,18.41 v36.47,17.5
DIO5
  Top 0.254: U4.7 59.47,27.14 58.21,28.39 37.51,28.39 36.4,27.28 U1.19
GND  (via drill 0.33)
  Top 0.203: U2.20 9.36,7.56 | 9.36,7.56 v8.67,6.88 | U2.18 9.89,7.78 9.78,7.67 9.47,7.67 9.36,7.56
  Top 0.254: J2.S4 3.7,15.89 L4.1 | v38.32,13.96 38.58,13.96 38.91,14.3 U1.47 | U1.8 41.83,20.19 v42.15,20.52 | U1.35 32.38,17.22 31.67,17.22 31.2,16.75 v31.2,16.12 | 35.9,22.85 35.53,22.47 v35.27,22.47
  Top 0.305: U1.23 34.4,25.08 C4.2 | U1.20 35.9,22.85 | U1.35 33.37,17.19 33.74,17.56 v33.74,18.15
  Top 0.406: J2.S3 3.6,22.71 2.64,23.66 1.61,23.66 | U5.3 9.28,31.01 v9.99,31.72
  Top 1.27: U4.8 65.97,22.38 BAT.2
  other vias: 4.21,33.04 4.26,31.52 11.93,31.75 9.98,29.92 11.9,29.96 5.44,23.42 36.3,36.35 2.36,21.28 2.33,19.24 41.27,38.58 43.61,38.6 46.15,38.45 44.63,38.02 23.46,6.52 8.44,26.95 10.39,26.92 16.01,25.75 17.2,23.95 26.45,26.57 46.18,32.26 7.8,34.64 10.04,34.64 10.01,33.4 11.82,33.4 12.55,34.87 6.84,38.71 6.71,37.31 11.66,38.58 14.46,38.58 16.49,38.45 6.06,5.53 2.58,3.17 0.98,5.53 8.52,0.78 12.46,2 2.6,37.59 1.66,36.52 1.17,34.77 11.64,37.31 13.09,9.62 13.09,10.76 30.09,2.71 44.72,17.04 28.56,36.29 34.09,28.75 29.32,25.14 13.53,6.14 9.79,0.86 6.74,0.78 43.7,14.12 27.78,11.42 28.92,12.31 24.85,12.06 26.76,12.06 18,11.93 18,12.82 20.28,12.57 18.5,6.14 19.44,6.72 20.16,9.26 20.28,10.41 20.33,6.16 62.25,35.91 62.79,35.1 63.4,35.76 65.99,35.4 62.89,39.59 58.88,36.32 60.53,36.95 60.48,35.86 60.73,34.59 61.36,33.7 62.23,33.22 64.46,33.09 65.51,33.14 29.9,29.89 33.33,32.31 44.51,32.05 37.01,39.42 35.74,39.29 39.43,39.04 42.22,36.5 22.71,31.29 15.09,35.23 42.3,9.42 43.96,11.32 41.29,8.02 38.49,4.21 39.89,4.08 39.38,2.05 40.53,2.05 42.81,2.43 43.57,3.32 40.91,3.96 47.26,19.2 49.54,19.32 52.34,19.2 57.54,19.2 60.34,19.2 63.39,18.94 55,19.2 47.38,16.4 49.8,16.53 52.46,16.66 55,16.66 57.93,16.78 60.34,16.78 63.26,16.53 47.26,13.99 50.31,13.86 47.26,11.45 50.31,11.7 62.75,13.23 62.75,10.31 62.88,7.38 47.89,5.61 47.89,3.45 50.43,3.45 50.43,5.61 53.1,5.73 53.1,3.32 55.89,5.73 56.02,3.07 58.43,5.86 58.69,3.07 61.74,5.99 61.86,3.32 30.44,10.53 30.06,6.98 33.11,6.34 32.35,2.66 33.74,2.79 28.28,2.02 14.36,24.36 19.56,26.26 21.72,28.8 24.14,27.78 23.12,26.13 25.02,25.63 25.66,28.04
  pour Top (rank 2): -1.99,41.09 66.65,41.09 66.67,31.7 69.39,31.7 69.39,28.77 66.82,28.77 66.8,21.31 45.49,21.31 45.49,-3.31 -1.99,-3.36
  pour Bottom: -2.04,-3.36 64.41,-3.36 64.41,20.8 66.93,21.31 66.77,28.77 69.39,28.77 69.34,31.65 66.7,31.65 66.67,41.09 -2.04,41.09
  pour Bottom (no thermals): 66.61,28.77 66.61,31.57 69.28,31.57 69.28,28.77
  pour Route2: -2.04,-3.36 64.41,-3.36 64.41,20.8 66.93,21.31 66.77,28.77 69.39,28.77 69.34,31.65 66.7,31.65 66.67,41.09 -2.04,41.09
  pour Route15: -2.04,-3.36 64.41,-3.36 64.41,20.8 66.93,21.31 66.77,28.77 69.39,28.77 69.34,31.65 66.7,31.65 66.67,41.09 -2.04,41.09
GPIO_RESET  (via drill 0.33)
  Top 0.254: U1.40 35.4,13.84 34.47,12.9 v32.56,12.9 | Q7.3 22.48,2.79 v22.65,2.61
  Bottom 0.254: v32.56,12.9 31.54,12.9 29,10.36 29,4.77 26.85,2.61 v22.65,2.61
GPIO_STANDBY  (via drill 0.33)
  Top 0.254: U1.39 34.9,14.23 34.54,13.86 v34.26,13.86 | v23.44,12.11 23.82,11.73 Q12.3
  Bottom 0.254: v23.44,12.11 23.44,12.42 23.85,12.82 28.17,12.82 29.64,14.3 33.83,14.3 v34.26,13.86
GPS_VCC
  Top 0.61: Q11.1 17.06,3.55 17.93,4.42 L3.1
GPS_VCC1
  Top 0.61: U3.8 26.28,3.05 26.34,2.99 24.18,2.99 23.8,3.37 23.8,4.19 C17.1 22.05,4.44 C11.+ L3.2
INT  (via drill 0.33)
  Top 0.203: v30.58,22.6 31.06,22.6 31.47,22.2 U1.25
  Top 0.254: v11.35,2.61 11.35,3.86 R27.1
  Bottom 0.254: v30.58,22.6 7.57,22.6 5.23,20.27 5.23,4.67 6.4,3.5 10.46,3.5 v11.35,2.61
LED1  (via drill 0.33)
  Top 0.254: U1.33 31.07,18.19 30.66,17.78 v30.33,17.78 | v14.68,17.78 13.44,17.78 R15.2
  Bottom 0.254: v30.33,17.78 v14.68,17.78
LED2  (via drill 0.33)
  Top 0.203: U1.29 31.62,20.19 31.29,20.52 31.29,21.1 v30.83,21.56
  Top 0.254: v14.68,21.56 13.58,21.56 R3.2
  Bottom 0.254: v30.83,21.56 v14.68,21.56
LED3  (via drill 0.33)
  Top 0.203: U1.32 30.55,18.69 v30.45,18.79
  Top 0.254: v14.81,18.79 13.38,18.79 R4.2
  Bottom 0.254: v30.45,18.79 v14.81,18.79
MISO
  Top 0.254: U4.2 49.47,25.32 47.93,26.87 38.78,26.87 37.9,25.99 U1.16
MOSI
  Top 0.254: U4.3 51.47,25.28 51.48,25.29 51.48,26.62 50.72,27.38 38.28,27.38 37.4,26.51 U1.17
N$1
  Top 0.813: U5.5 C15.1 16.74,28.1 R1.1
N$2
  Top 0.305: R34.2 L1.1
N$4
  Top 0.254: R9.2 18.14,32.28 CHRG.C
N$6
  Top 0.254: R15.1 9.47,17.68 9.14,18.01 STATUS.R-
N$7
  Top 0.254: R10.2 18.01,31.02 FAULT.C
N$8
  Top 0.813: Q4.2 29.33,34.01 28.13,32.81 R19.2
N$9
  Top 0.254: U1.4 42.62,18.19 Q3.3 43.06,19.96 C2.2
N$11
  Top 0.254: U5.6 R10.1
N$12
  Top 0.254: U1.3 42.51,17.69 Q3.4 43.09,17.11 C1.2
N$14
  Top 0.61: R16.2 14.99,8.05 Q13.1 16.18,8.39 16.18,7.06 16.84,6.4 16.84,5.72 Q11.3
N$15
  Top 0.254: U5.1 6.59,33.55 | 6.59,33.55 6.55,33.51 R13.2 R17.1 | R12.1 6.55,33.59 6.59,33.55
N$16
  Top 0.254: U5.2 7.58,32.28 7.41,32.11 7.41,31.23 7.08,30.9 6.54,30.9 R11.2
N$17
  Top 0.406: K1.3 29.08,23.77 29.08,23.83 29.08,23.86 R2.2
  Top 0.61: K1.6 28.73,16.87 K1.4 K1.3
N$18
  Top 0.254: STATUS.B- R3.1
N$19
  Top 0.254: STATUS.G- 12.4,18.8 R4.1
N$21  (via drill 0.13 pad 2.08)
  other vias: 68.25,34.13
N$22
  Top 0.203: R31.2 9.01,9.55 8.56,9.09 U2.22
N$23
  Top 0.293: R36.1 IPEX1.SIG arc-90 IPEX1.SIG
N$37
  Top 0.254: U3.18 36.61,10.75 36.88,10.49 37.55,10.49 R20.2
N$38
  Top 0.254: U3.17 36.7,9.65 36.88,9.47 37.51,9.47 R21.2
N$39
  Top 0.254: U3.16 R22.2
N$44
  Top 0.203: U2.9 8.56,4.7 8.07,4.21 6.86,4.21 6.2,3.55 R26.2
N$46
  Top 0.203: U2.10 8.96,4.44 8.28,3.76 7.57,3.76 7.31,3.5 C6.2
N$48
  Top 0.203: U2.11 9.36,3.8 8.68,3.12 R28.2
N$49
  Top 0.203: U2.12 9.76,4.03 9.9,3.88 R27.2
NSS  (via drill 0.33)
  Top 0.254: U1.38 34.4,15.87 v34.97,16.43 | U4.5 v55.47,24.55 v55.48,24.56
  Bottom 0.254: v34.97,16.43 38.12,16.43 38.4,16.71 38.4,25.35 39.16,26.11 54.66,26.11 55.48,25.29 v55.48,24.56
PA0
  Top 0.254: U1.10 41.74,21.19 42.72,22.17 43.61,22.17 43.86,22.42 43.86,22.93 R24.1 R23.1
PA1  (via drill 0.33)
  Top 0.254: R5.1 v18.34,33.98 | v35.1,21.41 35.48,21.41 35.74,21.15 39.04,21.15 39.57,21.69 U1.11
  Top 0.305: R6.1 R5.1
  Bottom 0.254: v35.1,21.41 34.47,21.41 33.58,22.3 33.58,23.06 32.94,23.69 19.99,23.69 18.34,25.35 v18.34,33.98
PA2
  Top 0.254: U1.12 40.9,22.79 42.06,23.95 R23.2
PA3  (via drill 0.33)
  Top 0.254: R37.1 R38.1 v25.7,31.44 | U1.13 39.4,22.41 38.91,21.92 v36.12,21.92
  Bottom 0.254: v25.7,31.44 34.85,31.44 36.12,30.17 v36.12,21.92
PB5
  Top 0.254: Q13.3 18.64,7.86 19.23,8.45 19.23,11.38 R33.2 20.65,11.53 22.15,13.03 31.29,13.03 32.31,12.01 33.83,12.01 34.08,12.26 34.47,12.26 35.9,13.7 U1.41
PB14
  Top 0.305: U1.27 33.18,21.19 33.42,21.43 33.42,22.58 33.04,22.96 31.52,22.96 31.27,23.21 31.27,23.84 R2.1 C7.2
RESET
  Top 0.254: U3.9 23.67,1.95 23.56,1.84 Q7.1
RF_IN
  Top 0.254: U3.11 | L1.2 37.39,3.05 | C9.1
  Top 0.293: U3.11 L1.2 | 37.39,3.05 C9.1 | C9.1 R8.1
RF_RESET
  Top 0.254: U4.6 57.47,26.72 56.31,27.89 37.89,27.89 36.9,26.9 U1.18
RST  (via drill 0.33)
  Top 0.254: v14.35,11.81 4.7,11.81 3.34,10.45 RST.P$1 | v35.61,19.12 36.18,19.69 U1.7
  Bottom 0.254: v14.35,11.81 14.35,15.85 15.62,17.12 22.58,17.12 23.26,16.43 30.15,16.43 30.99,17.27 34.26,17.27 34.72,17.73 34.72,18.23 v35.61,19.12
RXD_MODULE  (via drill 0.33)
  Top 0.254: U3.3 v31.47,8.55 v31.47,8.56 | U1.42 36.4,13.01 v35.94,12.54
  Bottom 0.254: v31.47,8.56 31.47,10.54 33.47,12.54 v35.94,12.54
SCK  (via drill 0.33)
  Top 0.254: U4.4 53.47,24.73 v53.38,24.83 | 47.68,25.09 v47.92,24.85 46.41,26.36 39.16,26.36 38.4,25.6 U1.15
  Bottom 0.254: v47.92,24.85 53.36,24.85 v53.38,24.83
SCL  (via drill 0.33)
  Top 0.203: U2.23 8.16,10.43 v7.95,10.64 | U1.30 31.33,19.69 30.38,20.65 v30.38,20.67
  Top 0.254: v7.95,10.64 R14.1
  Bottom 0.254: v30.38,20.67 7.69,20.67 6.27,19.25 6.27,12.32 v7.95,10.64
SDA  (via drill 0.33)
  Top 0.203: U2.24 7.76,8.95 R7.1 6.98,9.47 v6.98,8.81 | U1.31 31.17,19.19 30.66,19.71 v30.07,19.71
  Bottom 0.203: 11.02,19.07 10.96,19.01 9.78,17.83 9.78,11.86 9.09,11.17 9.09,10.08 8.58,9.57 7.74,9.57 v6.98,8.81
  Bottom 0.254: v30.07,19.71 11.66,19.71 10.96,19.01
STANDBY
  Top 0.254: U3.5 25.7,6.42 24.69,6.42 23.92,7.18 23.92,8.71 23.53,9.11 Q12.1
SWCLK
  Top 0.254: J2.P3 6.82,20.22 7.19,19.84 7.19,17.39 8.07,16.51 9.22,16.51 9.47,16.25 9.47,15.92 | 9.47,15.92 9.47,15.08 | D2.P$2 9.41,15.95 arc-45 9.47,15.92 | R29.2 9.35,15.03 arc45 9.47,15.08 | 9.47,15.08 9.47,14.12 9.98,13.61 32.26,13.61 33.84,15.19 U1.37
SWDIO
  Top 0.254: J2.P2 7.31,20.88 8,20.19 8,17.65 8.48,17.17 9.55,17.17 10.01,16.71 10.01,15.97 | U1.34 31.49,17.69 30.07,16.28 30.07,15.19 29.08,14.19 10.39,14.19 10.01,14.58 10.01,14.96 | 10.01,15.97 10.01,14.96 | D3.P$2 10.02,15.96 10.01,15.97 | R30.1 10.05,15 10.01,14.96
TXD_MODULE
  Top 0.254: U3.2 32.36,9.65 34.47,11.76 36.37,11.76 36.9,12.29 U1.43
UGND
  Top 0.406: J2.P5 5.18,18.9 5.8,18.27 L4.2
USB_5V
  Top 0.254: C20.1 C19.+ | FAULT.A CHRG.A | 17.95,36.95 17.91,36.98 | CHRG.A 19.65,36.75 19.89,36.98 | R37.2 22.91,32.71 22.65,32.97 22.65,36.98 | R12.2 5.63,35.76 5.89,36.01
  Top 0.305: U5.8 13.86,36.79 13.66,36.98
  Top 0.406: DD2.A R18.2 Q4.3
  Top 0.61: CHRG.A
  Top 0.813: 6.52,28.21 C16.1 7.25,29.53 7.47,29.74 U5.4 | 6.52,28.21 6.52,26.93 C19.+ | F1.1 11.92,27.74 11.45,28.21 6.52,28.21 | 6.52,28.21 3.77,28.21 2.95,29.03 2.95,34.6 4.37,36.01 5.89,36.01 12.69,36.01 13.66,36.98 17.91,36.98 19.89,36.98 22.65,36.98 26.92,36.98 27.72,37.78 DD2.A
VCC3V3_2
  Top 0.203: U2.8 8.16,4.86 7.95,4.64 5.69,4.64 5.08,4.03
  Top 0.254: C8.2 5.8,8.64 6.17,9.01 6.17,9.57 R7.2 R14.2 6.2,10.97 6.63,11.4 10.84,11.4 11.33,10.92 R31.1 11.58,9.29 11.58,5.81 | C37.2 5.08,4.03 4.9,4.03 4.57,4.37 4.57,7.29 4.95,7.67 5.69,7.67 C8.2 | 10.92,5.76 U2.13 | C8.2 U2.1
  Top 0.305: R32.2 11.61,5.81 11.58,5.81 10.92,5.81 10.92,5.76
  Top 0.406: C36.2 R32.2
VCC_RF
  Top 0.254: U3.14 35.58,6.24 R34.1
XUSB
  Top 0.406: J2.P1 6.18,21.54 6.4,21.76
  Top 0.61: F1.2 8.5,23.86 6.4,21.76

### Text on the board
tPlace: J2
bPlace: 433MHZ | 470MHZ | 868MHZ | 915MHZ
tNames: LoRa GPS Track / LGT-92 V1.5